# Altium schematic sheet 模拟开关.SchDoc
size A4
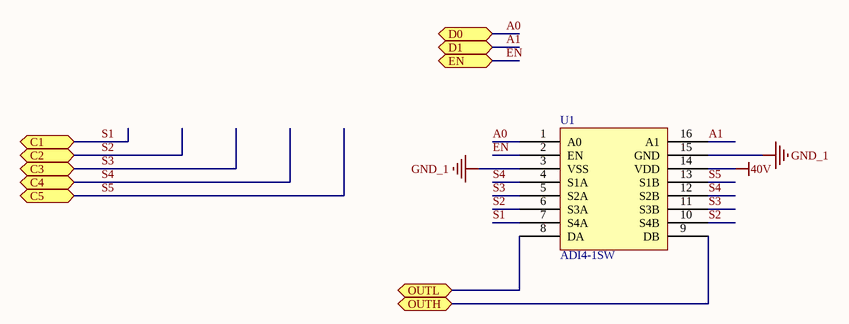
[diagram p0: 模拟开关.SchDoc]

## Parts
U1  ADI4-1SW  [TSSOP16]

## Ports
C1, C2, C3, C4, C5, D0, D1, EN, OUTH, OUTL

## Nets
40V: U1.14(VDD)
GND_1: U1.3(VSS) U1.15(GND)
A0: U1.1(A0) ; port D0
A1: U1.16(A1) ; port D1
EN: U1.2(EN) ; port EN
OUTH: U1.9(DB) ; port OUTH
OUTL: U1.8(DA) ; port OUTL
S1: U1.7(S4A) ; port C1
S2: U1.6(S3A) U1.10(S4B) ; port C2
S3: U1.5(S2A) U1.11(S3B) ; port C3
S4: U1.4(S1A) U1.12(S2B) ; port C4
S5: U1.13(S1B) ; port C5